# EAGLE design S12G-Micro-EVB RevB (EAGLE 6.2)
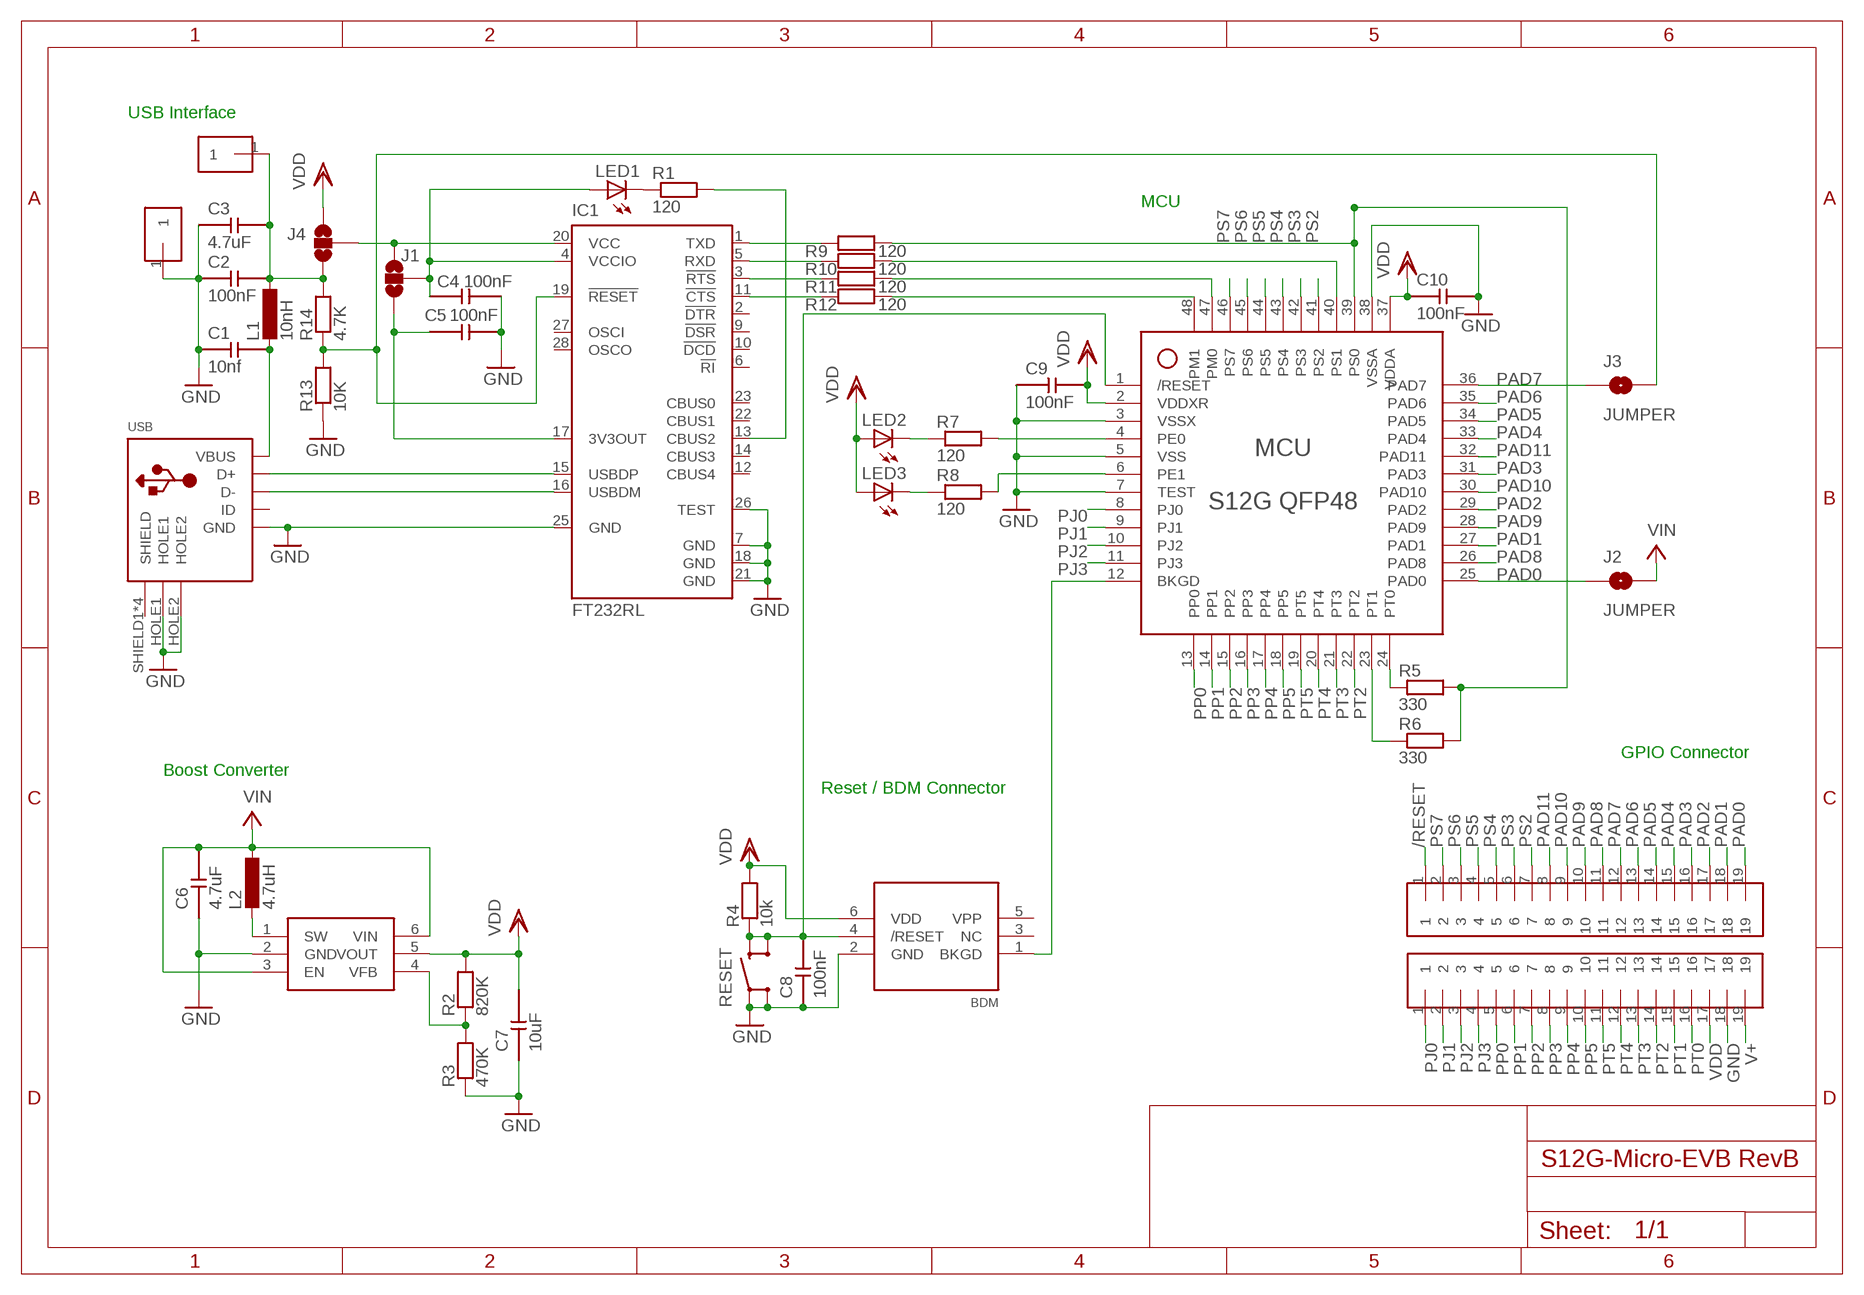
[diagram p0: schematic, sheet 1]

## Parts
BDM  BDM  [BDM]
BOTTOM  1X19  [1X19]
C1  10nf  C  [0805]
C2  100nF  C  [0805]
C3  4.7uF  C  [0805]
C4  100nF  C  [0805]
C5  100nF  C  [0805]
C6  4.7uF  C  [0805]
C7  10uF  C  [0805]
C8  100nF  C  [0805]
C9  100nF  C  [0805]
C10  100nF  C  [0805]
GND  1X1  [1X1]
IC1  FT232RL  [SSOP28]
IC2  MCP1640  [SOT23-6]
J1  JUMPER_2WAY  [JUMPER_2WAY]
J2  JUMPER  [JUMPER]
J3  JUMPER  [JUMPER]
J4  JUMPER_2WAY  [JUMPER_2WAY]
L1  10nH  L0805  [0805]
L2  4.7uH  LQH3C  [LQH3C@1]
LED1  LED0805  [0805]
LED2  LED0805  [0805]
LED3  LED0805  [0805]
MCU  S12G QFP48  S12G_QFP48  [QFP44]
R1  120  R  [0805]
R2  820K  R  [0805]
R3  470K  R  [0805]
R4  10k  R  [0805]
R5  330  R  [0805]
R6  330  R  [0805]
R7  120  R  [0805]
R8  120  R  [0805]
R9  120  R  [0805]
R10  120  R  [0805]
R11  120  R  [0805]
R12  120  R  [0805]
R13  10K  R  [0805]
R14  4.7K  R  [0805]
RESET  BUTTON  [BUTTON]
TOP  1X19  [1X19]
USB  USB  [USB_MINI_B]
VUSB  1X1  [1X1]

## Nets
3V3OUT: C5.2 IC1.17(3V3OUT) J1.3
/RESET: BDM.4(/RESET) C8.1 MCU.1(/RESET) R4.2 RESET.2 RESET.4 TOP.1
BKGD: BDM.1(BKGD) MCU.12(BKGD)
CBUS2: IC1.13(CBUS2) R1.1
CTS: MCU.48(PM1) R12.1
CTS_FT232RL: IC1.11(!CTS) R12.2
GND: BDM.2(GND) BOTTOM.18 C1.2 C2.2 C3.2 C4.1 C5.1 C6.2 C7.2 C8.2 C9.2 C10.1 GND.1 IC1.7(GND) IC1.18(GND) IC1.21(GND) IC1.25(GND) IC1.26(TEST) IC2.2(GND) MCU.3(VSSX) MCU.5(VSS) MCU.7(TEST) MCU.38(VSSA) R3.2 R13.2 RESET.1 RESET.3 USB.GND USB.HOLE1 USB.HOLE2
N$1: LED3.2(C) R8.2
N$2: IC2.4(VFB) R2.2 R3.1
N$3: LED2.2(C) R7.2
N$4: IC1.19(!RESET) J3.2 R13.1 R14.2
N$8: LED1.2(C) R1.2
N$11: IC2.1(SW) L2.3 L2.4
PAD0: J2.1 MCU.25(PAD0) TOP.19
PAD1: MCU.27(PAD1) TOP.18
PAD2: MCU.29(PAD2) TOP.17
PAD3: MCU.31(PAD3) TOP.16
PAD4: MCU.33(PAD4) TOP.15
PAD5: MCU.34(PAD5) TOP.14
PAD6: MCU.35(PAD6) TOP.13
PAD7: J3.1 MCU.36(PAD7) TOP.12
PAD8: MCU.26(PAD8) TOP.11
PAD9: MCU.28(PAD9) TOP.10
PAD10: MCU.30(PAD10) TOP.9
PAD11: MCU.32(PAD11) TOP.8
PE0: MCU.4(PE0) R7.1
PE1: MCU.6(PE1) R8.1
PJ0: BOTTOM.1 MCU.8(PJ0)
PJ1: BOTTOM.2 MCU.9(PJ1)
PJ2: BOTTOM.3 MCU.10(PJ2)
PJ3: BOTTOM.4 MCU.11(PJ3)
PP0: BOTTOM.5 MCU.13(PP0)
PP1: BOTTOM.6 MCU.14(PP1)
PP2: BOTTOM.7 MCU.15(PP2)
PP3: BOTTOM.8 MCU.16(PP3)
PP4: BOTTOM.9 MCU.17(PP4)
PP5: BOTTOM.10 MCU.18(PP5)
PS2: MCU.41(PS2) TOP.7
PS3: MCU.42(PS3) TOP.6
PS4: MCU.43(PS4) TOP.5
PS5: MCU.44(PS5) TOP.4
PS6: MCU.45(PS6) TOP.3
PS7: MCU.46(PS7) TOP.2
PT0: BOTTOM.16 MCU.24(PT0) R5.2
PT1: BOTTOM.15 MCU.23(PT1) R6.2
PT2: BOTTOM.14 MCU.22(PT2)
PT3: BOTTOM.13 MCU.21(PT3)
PT4: BOTTOM.12 MCU.20(PT4)
PT5: BOTTOM.11 MCU.19(PT5)
RTS: MCU.47(PM0) R11.1
RTS_FT232RL: IC1.3(!RTS) R11.2
RXD: MCU.39(PS0) R5.1 R6.1 R9.1
RXD_FT232RL: IC1.5(RXD) R10.2
TXD: MCU.40(PS1) R10.1
TXD_FT232RL: IC1.1(TXD) R9.2
USBDN: IC1.16(USBDM) USB.D-
USBDP: IC1.15(USBDP) USB.D+
V+: BOTTOM.19 C6.1 IC2.3(EN) IC2.6(VIN) J2.2 L2.1 L2.5 ; supply symbol labelled VIN
VBUS: C1.1 L1.2 USB.VBUS
VCC: IC1.20(VCC) J1.1 J4.2
VCCIO: C4.2 IC1.4(VCCIO) J1.2 LED1.1(A)
VDD: BDM.6(VDD) BOTTOM.17 C7.1 C9.1 C10.2 IC2.5(VOUT) J4.1 LED2.1(A) LED3.1(A) MCU.2(VDDXR) MCU.37(VDDA) R2.1 R4.1
VDDUSB: C2.1 C3.1 J4.3 L1.1 R14.1 VUSB.1
Unconnected: BDM.3(NC) BDM.5(VPP) IC1.2(!DTR) IC1.6(!RI) IC1.9(!DSR) IC1.10(!DCD) IC1.12(CBUS4) IC1.14(CBUS3) IC1.22(CBUS1) IC1.23(CBUS0) IC1.27(OSCI) IC1.28(OSCO) USB.ID

## Notes on the sheet
- USB Interface
- MCU
- GPIO Connector
- Boost Converter
- Reset / BDM Connector

## Power pins joined to a net without a drawn wire
SHIELD: USB.SHIELD1(SHIELD) USB.SHIELD2(SHIELD) USB.SHIELD3(SHIELD) USB.SHIELD4(SHIELD)

## Library data of the parts
BDM = myLibrary:BDM
BOTTOM TOP = myLibrary:1X19
C1-C10 = myLibrary:C
GND VUSB = myLibrary:1X1
IC1 = ftdichip:FT232R: Source: http://www.ftdichip.com/Documents/DataSheets/DS_FT232R_v104.pdf; MPN: FT232RL; OC_FARNELL: 1146032; OC_NEWARK: 91K9918
IC2 = myLibrary:MCP1640
J1 J4 = myLibrary:JUMPER_2WAY
J2 J3 = myLibrary:JUMPER
L1 = myLibrary:L
L2 = myLibrary:LQH3C
LED1-LED3 = myLibrary:LED
MCU = myLibrary:S12G_QFP48
R1-R14 = myLibrary:R
RESET = myLibrary:BUTTON
USB = myLibrary:USB

## Board
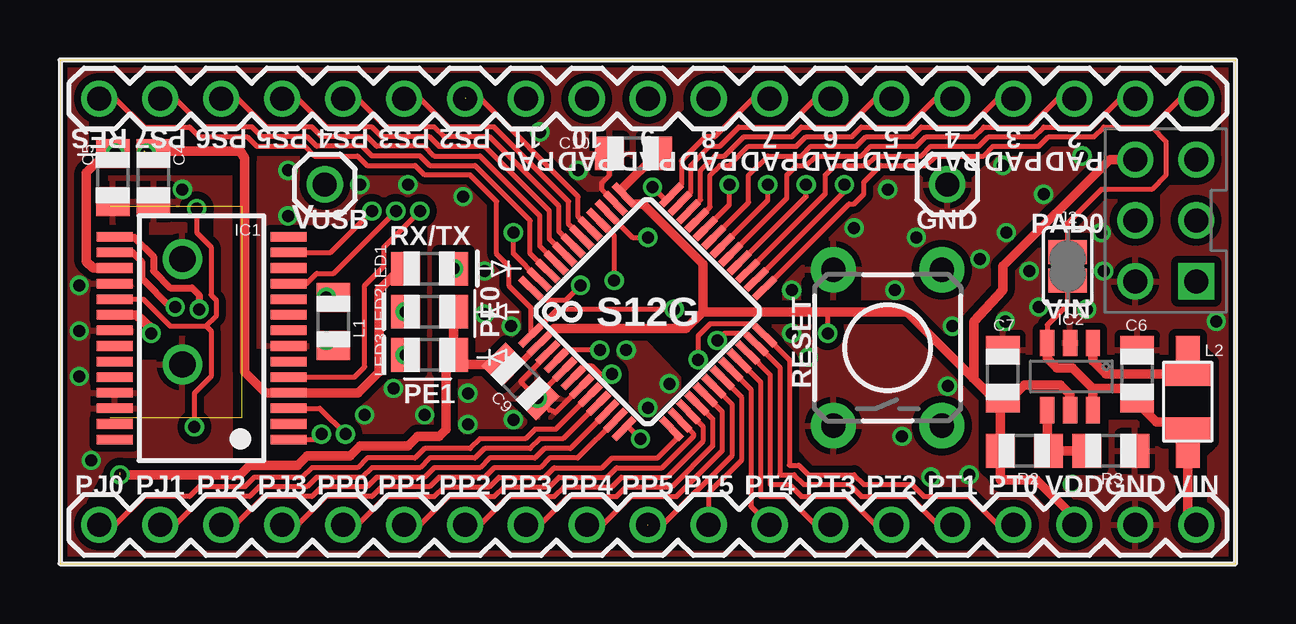
[diagram p1: board, top side]
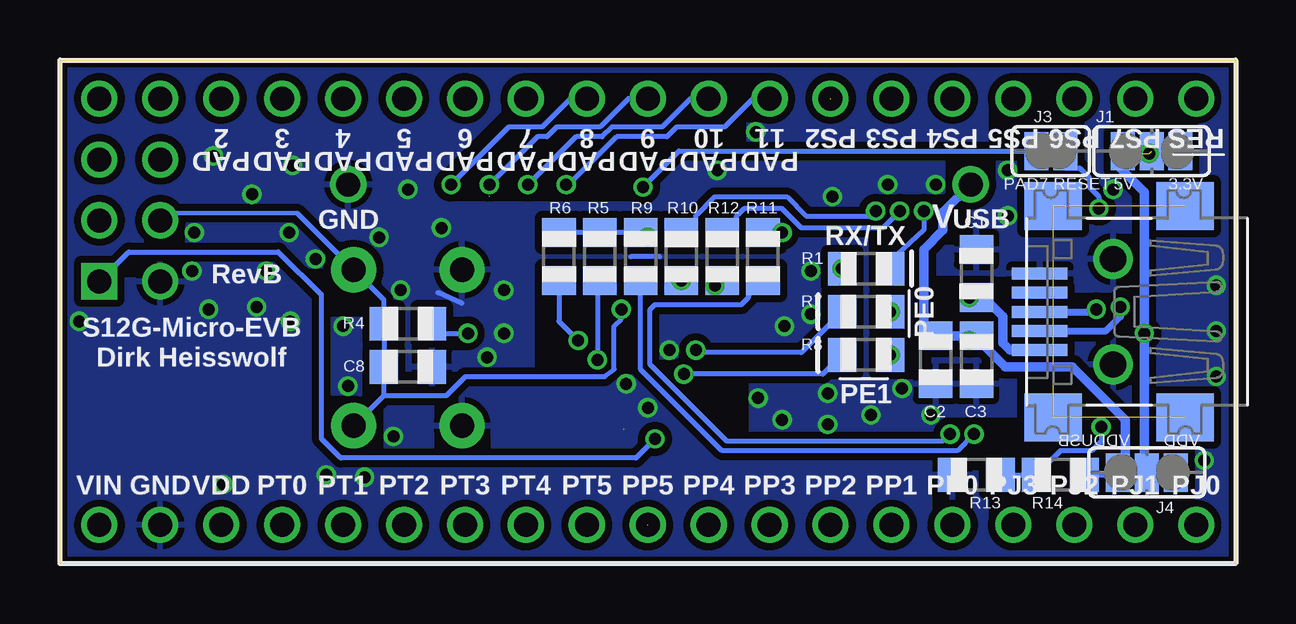
[diagram p2: board, bottom side, seen from below]

Size 49 x 21 mm. Coordinates in mm from the lower left corner, seen from the top.
Outline: 0,0 49,0 49,21 0,21 0,0
Copper layers (1*16): Top 0.035mm / dielectric 1.5mm / Bottom 0.035mm
Design rules: minimum track width 6mil, minimum drill 12mil, track to track 6mil, track to pad 6mil, pad to pad 6mil, via to via 6mil, smd to smd 0mil, copper to edge 10mil, drill to drill 10mil, minimum pad ring 10mil, minimum via ring 6mil, stop-mask expansion 2mil, vias tented up to drill 100mil, thermal gap 10mil
tRestrict: 74 lines
bRestrict: 55 lines

### Footprints (pad centres in the part's own frame; a part is rotated, then mirrored left to right if it is on the bottom)
BDM = drill 1 square: 1 -1.27,2.54 | drill 1: 2 1.27,2.54; 3 -1.27,0; 4 1.27,0; 5 -1.27,-2.54; 6 1.27,-2.54
1X19 = drill 1: 1 0,0; 2 2.54,0; 3 5.08,0; 4 7.62,0; 5 10.16,0; 6 12.7,0; 7 15.24,0; 8 17.78,0; 9 20.32,0; 10 22.86,0; 11 25.4,0; 12 27.94,0; 13 30.48,0; 14 33.02,0; 15 35.56,0; 16 38.1,0; 17 40.64,0; 18 43.18,0; 19 45.72,0
0805 = smd 1.2 x 1.4: 1 -1,0; 2 1,0
1X1 = drill 1: 1 0,0
SSOP28 = smd 0.4 x 1.5: 1 -4.225,-3.625; 2 -3.575,-3.625; 3 -2.925,-3.625; 4 -2.275,-3.625; 5 -1.625,-3.625; 6 -0.975,-3.625; 7 -0.325,-3.625; 8 0.325,-3.625; 9 0.975,-3.625; 10 1.625,-3.625; 11 2.275,-3.625; 12 2.925,-3.625; 13 3.575,-3.625; 14 4.225,-3.625; 15 4.225,3.625; 16 3.575,3.625; 17 2.925,3.625; 18 2.275,3.625; 19 1.625,3.625; 20 0.975,3.625; 21 0.325,3.625; 22 -0.325,3.625; 23 -0.975,3.625; 24 -1.625,3.625; 25 -2.275,3.625; 26 -2.925,3.625; 27 -3.575,3.625; 28 -4.225,3.625
SOT23-6 = smd 0.6 x 1.1: 1 -0.95,-1.4; 2 0,-1.4; 3 0.95,-1.4; 4 0.95,1.4; 5 0,1.4; 6 -0.95,1.4
JUMPER_2WAY = smd 1 x 1.6: 1 -1.2,0; 2 0,0; 3 1.2,0
JUMPER = smd 1 x 1.6: 1 -0.6,0; 2 0.6,0
LQH3C@1 = smd 1 x 2: 1 -1.1,0; 3 1.2,0 | smd 2.1 x 1: 4 1.75,0; 5 -1.65,0
QFP44 = smd 1.2 x 0.3: 1 -4.15,2.75; 2 -4.15,2.25; 3 -4.15,1.75; 4 -4.15,1.25; 5 -4.15,0.75; 6 -4.15,0.25; 7 -4.15,-0.25; 8 -4.15,-0.75; 9 -4.15,-1.25; 10 -4.15,-1.75; 11 -4.15,-2.25; 12 -4.15,-2.75; 25 4.15,-2.75; 26 4.15,-2.25; 27 4.15,-1.75; 28 4.15,-1.25; 29 4.15,-0.75; 30 4.15,-0.25; 31 4.15,0.25; 32 4.15,0.75; 33 4.15,1.25; 34 4.15,1.75; 35 4.15,2.25; 36 4.15,2.75 | smd 0.3 x 1.2: 13 -2.75,-4.15; 14 -2.25,-4.15; 15 -1.75,-4.15; 16 -1.25,-4.15; 17 -0.75,-4.15; 18 -0.25,-4.15; 19 0.25,-4.15; 20 0.75,-4.15; 21 1.25,-4.15; 22 1.75,-4.15; 23 2.25,-4.15; 24 2.75,-4.15; 37 2.75,4.15; 38 2.25,4.15; 39 1.75,4.15; 40 1.25,4.15; 41 0.75,4.15; 42 0.25,4.15; 43 -0.25,4.15; 44 -0.75,4.15; 45 -1.25,4.15; 46 -1.75,4.15; 47 -2.25,4.15; 48 -2.75,4.15
BUTTON = drill 1.016 pad 1.88: 1 -3.251,2.261; 2 -3.251,-2.261; 3 3.251,2.261; 4 3.251,-2.261
USB_MINI_B = smd 0.5 x 2.308: D+ 0,4.064; D- -0.8,4.064; GND 1.6,4.064; ID 0.8,4.064; VBUS -1.6,4.064 | drill 1.1: HOLE1 -2.2,1; HOLE2 2.2,1 | smd 2 x 2.4: SHIELD1 -4.4,-2; SHIELD2 -4.4,3.5; SHIELD3 4.4,3.5; SHIELD4 4.4,-2

### Placement (x,y rotation side)
BDM  46.09,14.31 180 top
BOTTOM  1.64,1.61 0 top
C1  10.8,12.1 90 bottom
C2  12.5,8.5 270 bottom
C3  10.8,8.5 270 bottom
C4  3.9,16.1 90 top
C5  2.2,16.1 90 top
C6  44.9,7.9 90 top
C7  39.3,7.9 90 top
C8  34.5,8.2 0 bottom
C9  19.2,7.6 315 top
C10  23.9,17.1 0 top
GND  36.98,15.81 0 top
IC1  5.9,9.4 90 top
IC2  42.1,7.8 180 top
J1  3.5,17.2 0 bottom
J2  42,12.4 270 top
J3  7.7,17.2 0 bottom
J4  3.7,3.8 180 bottom
L1  11.4,10.1 90 top
L2  47,6.7 90 top
LED1  15.4,12.3 0 top
LED2  15.4,10.5 180 top
LED3  15.4,8.7 180 top
MCU  24.5,10.5 45 top
R1  15.4,12.3 180 bottom
R2  40.2,4.7 0 top
R3  43.8,4.7 0 top
R4  34.5,10 180 bottom
R5  26.5,12.8 270 bottom
R6  28.2,12.8 270 bottom
R7  15.4,10.5 0 bottom
R8  15.4,8.7 0 bottom
R9  24.8,12.8 270 bottom
R10  23.1,12.8 90 bottom
R11  19.7,12.8 270 bottom
R12  21.4,12.8 90 bottom
R13  10.8,3.7 180 bottom
R14  7.3,3.7 180 bottom
RESET  34.5,9 90 top
TOP  1.64,19.39 0 top
USB  4.1,10.5 90 bottom
VUSB  11.04,15.81 0 top

### Tracks (layer width: path | path; a pad name or v marks a point on that pad's centre or on a via)
3V3OUT  (via drill 0.5)  (2 unrouted)
  Top 0.4: IC1.17 1.38,12.32 1.1,12.6 1.1,16.3 1.9,17.1
  Bottom 0.4: J1.3 v2.3,17.1
/RESET  (via drill 0.5)
  Top 0.2: TOP.1 2.31,19.39 3.5,18.2 5.4,18.2 5.8,17.8 7.8,17.8 8.2,17.4 10.2,17.4 10.6,17 12.4,17 12.8,16.6 14.8,16.6 15.2,16.2 17.1,16.2 18.2,15.1 18.2,12.9 18.7,12.4 18.7,11.6 19.62,10.68 MCU.1 | MCU.1 | v25.6,10.6 20.71,10.6 MCU.1
  Bottom 0.2: RESET.2 35.5,7.01 | 35.5,7.01 C8.1 R4.2 35.5,10.99 RESET.4 39.12,14.61 44.6,14.6 44.82,14.38 BDM.4 | 35.5,7.01 32.89,7.01 32.1,7.8 26.3,7.8 25.9,8.1 25.9,9.9 25.6,10.2 v25.6,10.6
BKGD  (via drill 0.5)
  Top 0.2: 23.5,5.6 MCU.12 23.59,5.7 23.7,5.7 v24.2,5.2
  Bottom 0.2: BDM.1 46.13,13 39.9,13 38.1,11.2 38.1,5.2 37.3,4.4 25,4.4 v24.2,5.2
CBUS2  (via drill 0.5)
  Top 0.2: IC1.13 11.28,12.97 v13,14.7
  Bottom 0.2: 14,12.9 R1.1 14.4,12.6 13,13.9 v13,14.7
CTS  (via drill 0.5)
  Top 0.2: MCU.48 20.11,11 21.1,11 v21.7,11.6
  Bottom 0.2: 21.9,11.8 R12.1 21.6,11.6 v21.7,11.6
CTS_FT232RL  (via drill 0.5)
  Top 0.2: IC1.11 10.28,11.68 10.7,12.1 11.4,12.1 v14,14.7
  Bottom 0.2: R12.2 20.8,14.2 20.8,14.5 20.5,14.8 18.9,14.8 18.1,14 14.7,14 v14,14.7
GND  (via drill 0.5)
  Top 0.2: MCU.38 22.6,15.58 22.6,15.9 22.9,16.2 C10.1 | MCU.5 19.91,6.97 C9.2 | MCU.7 20.65,6.3 20.4,6.4 C9.2 | C9.2 | MCU.3 20.33,8.73 19.2,7.6 v19.9,6.9 C9.2 | C9.2
  Bottom 0.2: 24,12.8 25.2,12.8 | 32.25,10.85 33.25,11.3
  other vias: 39.4,10.1 9.5,16.4 0.8,9.7 0.8,11.6 21.6,16.4 40.4,12.2 42.6,17 35.7,13.6 35.1,5.3 42.2,3.3 20,18 18.9,6 30.5,9.6 30.5,11.4 34.8,11.4 42.8,10.6 40.8,10.7 48.2,10.1 41,15.4 38.35,12.7 43.4,13.8 39.45,13.8 43.5,12.2 37.2,9.9 37,7.4 33.1,14 24.5,6.5 18.8,9.9 23.6,8.9 16.8,15.3 14.5,15.8 39.3,16.6 34.5,15.6 37.9,3.7 1.3,4.3 15.2,6.2 36.3,3.6 25.4,7.5 12.5,15.8 9.5,14.5 12.7,6.2 17,5.8 13.9,7.3 17.7,12.2 17.7,10.4 17,7.1 31.2,8.6 5.1,15.6 0.8,7.8
  pour Bottom (isolate 0.3): 0.2,0.2 48.9,0.1 48.7,20.8 0.1,20.8
  pour Top (isolate 0.3): 0.3,0.2 48.7,0.2 48.7,20.8 0.3,20.8
N$1  (via drill 0.5)
  other vias: 14.4,8.7
N$2
  Top 0.4: R3.1 R2.2 41.15,4.35 IC2.4
N$3  (via drill 0.5)
  other vias: 14.4,10.5
N$4  (via drill 0.5)
  Top 0.2: IC1.19 3.48,11.03 4.6,9.9 6.1,9.9 | 6.1,9.9 6.3,9.7 6.3,7.8 5.6,7.1 v5.6,5.7 | v5.7,14.8 5.7,13.8 6.3,13.2 6.3,11.2 6.5,11 6.5,10.3 6.1,9.9
  Bottom 0.2: v5.6,5.7 5.6,5.1 6,4.7 7.3,4.7 R14.2 R13.1 | J3.2 7.1,16.5 6.5,16.5 6.1,16.1 6.1,15.7 5.7,15.3 v5.7,14.8
N$8  (via drill 0.5)
  other vias: 16.4,12.3
N$11
  Top 0.2: L2.3 L2.4
  Top 0.4: 43.1,9.2 IC2.1 43.05,8.45 43.6,7.9 L2.3
PAD0
  Top 0.2: 45.5,18.2 46.69,19.39 TOP.19 | MCU.25 32.89,15 33.1,15 33.5,15.4 33.5,15.9 34.2,16.6 36.1,16.6 36.5,17 38.5,17 38.9,17.4 40.8,17.4 41.2,17.8 43.1,17.8 43.5,18.2 45.5,18.2 | J2.1 42,14.2 43.4,15.6 45.5,15.6 46.1,16.2 46.1,17.6 45.5,18.2
PAD1
  Top 0.2: TOP.18 44.19,19.39 43,18.2 41,18.2 40.6,17.8 38.7,17.8 38.3,17.4 36.3,17.4 35.9,17 34,17 33.6,16.6 32.3,16.6 31.9,16.2 31.9,15.43 MCU.27
PAD2
  Top 0.2: TOP.17 41.59,19.39 40.4,18.2 38.5,18.2 38.1,17.8 36.1,17.8 35.7,17.4 33.8,17.4 33.4,17 31.5,17 31.1,16.6 30.7,16.6 30.3,16.2 30.3,15.24 MCU.29
PAD3
  Top 0.2: TOP.16 39.09,19.39 37.9,18.2 35.9,18.2 35.5,17.8 33.6,17.8 33.2,17.4 31.3,17.4 30.9,17 29.5,17 28.7,16.2 28.7,15.05 MCU.31
PAD4
  Top 0.2: MCU.33 27.1,14.87 27.1,16.2 27.5,16.6 27.9,16.6 28.7,17.4 30.7,17.4 31.1,17.8 33,17.8 33.4,18.2 35.3,18.2 36.49,19.39 TOP.15
PAD5
  Top 0.2: MCU.34 26.7,15.18 26.7,16.4 27.3,17 27.7,17 28.5,17.8 30.5,17.8 30.9,18.2 32.8,18.2 33.99,19.39 TOP.14
PAD6
  Top 0.2: TOP.13 31.49,19.39 30.3,18.2 28.3,18.2 27.5,17.4 27.1,17.4 26.3,16.6 26.3,15.48 MCU.35
PAD7  (via drill 0.5)
  Top 0.2: TOP.12 28.89,19.39 27.3,17.8 26.9,17.8 25.9,16.8 25.9,15.8 MCU.36 | MCU.36 | MCU.36 25.3,15.2 25.2,15.2 v24.7,15.7
  Bottom 0.2: v24.7,15.7 23.2,17.2 J3.1
PAD8  (via drill 0.5)
  Top 0.2: MCU.26 32.7,15.52 v32.7,15.8
  Bottom 0.2: TOP.11 27.71,19.39 28.9,18.2 30.3,18.2 v32.7,15.8
PAD9  (via drill 0.5)  (1 unrouted)
  Top 0.2: 31.1,15.33 v31.1,15.8 | MCU.28 28.35,12.55 31.1,15.3
  Bottom 0.2: TOP.10 25.31,19.39 26.5,18.2 28.3,18.2 28.7,17.8 29.1,17.8 v31.1,15.8
PAD10  (via drill 0.5)
  Top 0.2: MCU.30 29.5,15.15 v29.5,15.8
  Bottom 0.2: TOP.9 22.71,19.39 23.9,18.2 26,18.2 26.4,17.8 27.5,17.8 v29.5,15.8
PAD11  (via drill 0.5)
  Top 0.2: MCU.32 27.9,14.96 v27.9,15.8
  Bottom 0.2: TOP.8 20.11,19.39 21.3,18.2 23.3,18.2 23.7,17.8 25.8,17.8 27.8,15.8 v27.9,15.8
PE0  (via drill 0.5)
  Top 0.2: v22.5,8.9 21.13,8.9 MCU.4
  Bottom 0.2: R7.1 18.1,8.8 22.4,8.8 v22.5,8.9
PE1  (via drill 0.5)
  Top 0.2: MCU.6 21.9,8.25 22.15,8.25 22.51,7.9 v23,7.9
  Bottom 0.2: R8.1 17.2,7.9 v23,7.9
PJ0
  Top 0.2: MCU.8 20.66,5.6 19.8,5.6 19.4,5.2 17.5,5.2 17.1,4.8 15.2,4.8 14.8,4.4 12.8,4.4 12.4,4 10.5,4 10.1,3.6 8.1,3.6 7.7,3.2 5.8,3.2 5.4,2.8 3.5,2.8 2.31,1.61 BOTTOM.1
PJ1
  Top 0.2: BOTTOM.2 4.81,1.61 6,2.8 7.9,2.8 8.3,3.2 10.3,3.2 10.7,3.6 12.6,3.6 13,4 15,4 15.4,4.4 17.3,4.4 17.7,4.8 19.6,4.8 20,5.2 20.97,5.2 MCU.9
PJ2
  Top 0.2: BOTTOM.3 7.31,1.61 8.5,2.8 10.5,2.8 10.9,3.2 12.8,3.2 13.2,3.6 15.2,3.6 15.6,4 17.5,4 17.9,4.4 19.8,4.4 20.2,4.8 21.27,4.8 MCU.10
PJ3
  Top 0.2: BOTTOM.4 9.91,1.61 11.1,2.8 13,2.8 13.4,3.2 15.4,3.2 15.8,3.6 17.7,3.6 18.1,4 20,4 20.4,4.4 21.58,4.4 MCU.11
PP0  (1 unrouted)
  Top 0.2: BOTTOM.5 12.41,1.61 13.6,2.8 15.6,2.8 16,3.2 17.9,3.2 18.3,3.6 20.2,3.6 20.6,4 22.6,4 23,4.4 24.9,4.4 25.7,5.2 25.7,5.4 25.5,5.6
PP1
  Top 0.2: MCU.14 26.4,5.42 26.4,5.3 25.1,4 23.2,4 22.8,3.6 20.8,3.6 20.4,3.2 18.5,3.2 18.1,2.8 16.2,2.8 15.01,1.61 BOTTOM.6
PP2
  Top 0.2: MCU.15 26.8,5.72 26.8,5.1 25.3,3.6 23.4,3.6 23,3.2 21,3.2 20.6,2.8 18.7,2.8 17.51,1.61 BOTTOM.7
PP3
  Top 0.2: MCU.16 27.2,6.03 27.2,4.9 25.5,3.2 23.6,3.2 23.2,2.8 21.2,2.8 20.01,1.61 BOTTOM.8
PP4
  Top 0.2: MCU.17 27.6,6.34 27.6,4.7 25.7,2.8 23.8,2.8 22.61,1.61 BOTTOM.9
PP5  (1 unrouted)
  Top 0.2: MCU.18 28,6.65 28,4.5 25.1,1.6 BOTTOM.10
PS2  (1 unrouted)
  Top 0.2: MCU.41 21.6,14.46 21.6,15.3 17.5,19.4 16.9,19.4
PS3
  Top 0.2: TOP.6 15.01,19.39 16.2,18.2 18.1,18.2 21.2,15.1 21.2,14.15 MCU.42
PS4
  Top 0.2: TOP.5 12.41,19.39 13.6,18.2 15.6,18.2 16,17.8 17.9,17.8 20.8,14.9 20.8,13.85 MCU.43
PS5
  Top 0.2: TOP.4 9.91,19.39 11.1,18.2 13,18.2 13.4,17.8 15.4,17.8 15.8,17.4 17.7,17.4 20.4,14.7 20.4,13.54 MCU.44
PS6
  Top 0.2: TOP.3 7.41,19.39 8.6,18.2 10.5,18.2 10.9,17.8 12.8,17.8 13.2,17.4 15.2,17.4 15.6,17 17.5,17 20,14.5 20,13.23 MCU.45
PS7
  Top 0.2: TOP.2 4.81,19.39 6,18.2 8,18.2 8.4,17.8 10.3,17.8 10.7,17.4 12.6,17.4 13,17 15,17 15.4,16.6 17.3,16.6 19.6,14.3 19.6,12.93 MCU.46
PT0  (via drill 0.5)
  Top 0.2: BOTTOM.16 39.09,1.61 37.9,2.8 36,2.8 35.5,3.3 33.5,3.3 33.1,3.7 31.2,3.7 30.8,4.1 30.4,4.1 30.4,8.49 MCU.24 28.89,10 27.1,10 26.6,9.5 v26.6,8.5
  Bottom 0.2: R5.2 26.6,11.7 v26.6,8.5
PT1  (via drill 0.5)
  Top 0.2: BOTTOM.15 36.59,1.61 35.4,2.8 33.4,2.8 32.9,3.3 31,3.3 30.6,3.7 30,3.7 30,8.18 MCU.23 28.58,9.6 27.7,9.6 v27.4,9.3
  Bottom 0.2: R6.2 28.2,10.1 v27.4,9.3
PT2
  Top 0.2: MCU.22 29.6,7.88 29.6,3.3 30.4,3.3 30.9,2.8 32.8,2.8 33.99,1.61 BOTTOM.14
PT3
  Top 0.2: MCU.21 29.2,7.57 29.2,2.8 30.3,2.8 31.49,1.61 BOTTOM.13
PT4
  Top 0.2: MCU.20 28.8,7.26 28.8,2.39 BOTTOM.12
PT5
  Top 0.2: MCU.19 28.4,6.95 28.4,4.3 27.04,2.94 BOTTOM.11
RTS  (via drill 0.5)
  Top 0.2: MCU.47 18.9,12.92 v18.9,13.8
  Bottom 0.2: R11.1 v18.9,13.8
RTS_FT232RL  (via drill 0.5)
  Top 0.2: IC1.3 10.82,6.47 v11.9,5.4
  Bottom 0.2: R11.2 20.3,11.2 20.3,11.1 20.6,10.8 24.2,10.8 24.4,10.6 24.4,8.3 21.2,5.1 12.2,5.1 v11.9,5.4
RXD  (via drill 0.5)
  Top 0.2: MCU.39 23.88,13.6 v24.5,13.6
  Bottom 0.2: R9.1 24.6,13.6 v24.5,13.6 24.7,13.8 R9.1 | R9.1 R5.1 R6.1
RXD_FT232RL  (via drill 0.5)
  Top 0.2: IC1.5 12.28,7.78 12.7,8.2 12.7,11.6 13.5,12.4 13.5,13.2 v15,14.7
  Bottom 0.2: R10.2 22.5,14.4 22.5,14.5 21.7,15.3 18.7,15.3 17.9,14.5 15.2,14.5 v15,14.7
SHIELD  (3 unrouted)
TXD  (via drill 0.5)
  Top 0.2: MCU.40 23.1,13.67 R10.1
  other vias: 23.1,11.8
TXD_FT232RL  (via drill 0.5)
  Top 0.2: IC1.1 10.68,5.17 v10.9,5.4
  Bottom 0.2: R9.2 24.7,11.8 24.8,11.7 24.8,8.1 21.4,4.7 11.6,4.7 v10.9,5.4
USBDN  (via drill 0.5)
  Top 0.3: IC1.16 3.02,12.97 3.4,12.6 3.4,11.9 4.6,10.7 v4.8,10.7
  Bottom 0.3: USB.D- 5.4,9.7 4.8,10.3 v4.8,10.7
USBDP  (via drill 0.5)
  Top 0.3: IC1.15 3.1,13.6 3.9,12.8 3.9,12.2 4.6,11.5 5.5,11.5 5.8,11.2 v5.8,10.6
  Bottom 0.3: USB.D+ 6,10.5 v5.8,10.6
V+
  Top 0.2: J2.2 42,10.8 41.15,9.95 IC2.3 | C6.1 44.9,7.3
  Top 0.4: 44.54,6.49 C6.1 44.9,6.7 45.7,5.9 46.7,5.9 L2.1 L2.5 47,1.97 BOTTOM.19 | 43.05,7.3 42.2,8.15 41.55,8.15 41.15,8.55 IC2.3 | IC2.6 43.05,7.3 | 43.05,7.3 44.9,7.3
VBUS  (via drill 0.5)  (2 unrouted)
  Bottom 0.4: USB.VBUS 9.4,8.9 9.7,9.2 9.7,10.3 10.5,11.1 C1.1
  other vias: 11.1,11.1
VCC  (via drill 0.5)
  Top 0.4: IC1.20 3.2,10.38 3.8,9.8 v3.8,9.6
  Bottom 0.4: J4.2 3.8,3.8 v3.8,9.6 3.8,15.5 4.9,16.6 J1.1
VCCIO  (via drill 0.5)  (2 unrouted)
  Top 0.3: 14.3,12.3 LED1.1
  Top 0.4: C4.2 4.1,17.2 7.5,17.2 7.7,16.9 7.7,8 8.57,7.12 IC1.4 12.43,7.12 13.3,8 13.3,11.4 14.2,12.3 LED1.1
  other vias: 3.6,17.1
VDD  (via drill 0.5)  (1 unrouted)
  Top 0.2: MCU.2 20,9.18 20,9.2 | 23.99,15 MCU.37 23.3,15.59 23.3,15.6 23.41,15.61 | v32,9.6 32,10.5
  Top 0.3: C9.1 19.12,8.31 MCU.2 20.52,9.7
  Top 0.4: IC2.5 42.1,7.05 41.7,7.45 40.2,7.45 39.85,7.1 39.3,7.1 | 39.3,7.1 C7.1 39.2,6.9 R2.1 39.2,3.5 40.69,3.5 42.3,1.9 BOTTOM.17 | 26.8,10.5 26.8,12.49 24.3,15 23.99,15 | 26.8,10.5 32,10.5 35.3,10.5 38.05,7.75 | 26.8,10.5 26.1,9.8 20.6,9.8 20.52,9.7 | 38.05,7.75 38.7,7.1 39.3,7.1 | BDM.6 43.75,16.85 39.3,12.4 39.3,11.4 38.1,10.1 38.1,7.75 38.05,7.75 | 23.41,15.61 C10.2 | v2.5,3.7 7.5,3.7 7.9,4.1 9.9,4.1 10.3,4.5 12.1,4.5 12.5,4.9 14.5,4.9 14.9,5.3 15.8,5.3 16.1,5.6 16.1,8.4 LED3.1 | C9.1 16.79,8.31 LED3.1 | LED3.1 LED2.1
  Bottom 0.2: 33.2,9.6 v32,9.6
  Bottom 0.4: R4.1 33.2,9.6
VDDUSB  (via drill 0.5)
  Top 0.2: v11.1,9.3 11.2,9.3 L1.1
  Bottom 0.2: R14.1 5,3.7 J4.3 | C3.1 10.9,9.5 v11.1,9.3
  Bottom 0.4: C3.1 C2.1 13,10 13,13.1 12.2,13.9 12.2,14.65 VUSB.1 | J4.3 4.9,4.1 4.6,3.8 4.6,6 6.8,8.2 9.6,8.2 11,9.6 v11.1,9.3

### Text on the board
bNames: 3.3V | 5V | RESET | PAD7 | VDD | VDDUSB
tSilk: RES | RES | PS7 | PS6 | PS5 | PS4 | PS3 | PS2 | 11 | 10 | 9 | 8 | 7 | 6 | 5 | 4 | 3 | 2 | PAD | PAD | PAD | PAD | PAD | PAD | PAD | PAD | PAD | PAD | V | USB | GND | PAD0 | RX/TX | VIN | PE0 | S12G | PE1 | RESET | PJ0 | PJ1 | PJ2 | PJ3 | PP0 | PP1 | PP2 | PP3 | PP4 | PP5 | PT5 | PT4 | PT3 | PT2 | PT1 | PT0 | VDD | GND | VIN
_bsilk: RES | RES | PS7 | PS6 | PS5 | PS4 | PS3 | PS2 | 11 | 10 | 9 | 8 | 7 | 6 | 5 | 4 | 3 | 2 | PAD | PAD | PAD | PAD | PAD | PAD | PAD | PAD | PAD | PAD | USB | V | GND | RX/TX | RevB | PE0 | S12G-Micro-EVB | PE1 | Dirk Heisswolf | PJ0 | PJ1 | PJ2 | PJ3 | PP0 | PP1 | PP2 | PP3 | PP4 | PP5 | PT5 | PT4 | PT3 | PT2 | PT1 | PT0 | VDD | GND | VIN